# Altium schematic sheet v1.0.SchDoc
size 177 x 44 mm; PageSetup: Record=PageOptions|CenterHorizontal=True|CenterVertical=True|PrintScale=0.71|XCorrection=1.00|YCorrection=1.00|PrintKind=1|BorderSize=5000000|LeftOffset=0|BottomOffset=0|Orientation=2|PaperLength=1000|PaperWidth=1000|Scale=100|PaperSource=15|PrintQuality=4000|MediaType=1|DitherType=10|PrintScaleMode=1|PaperKind=A4|PaperIndex=9
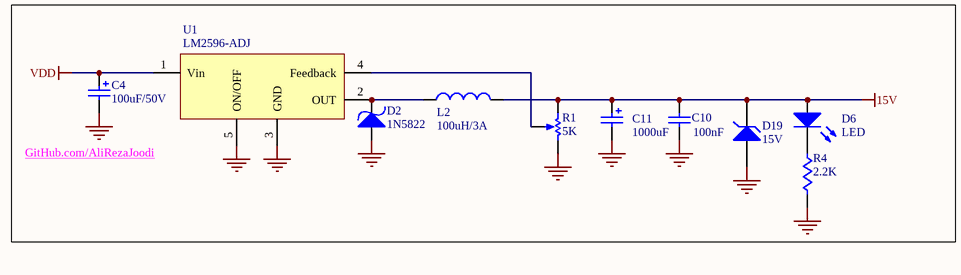
[diagram p0: v1.0.SchDoc]

## Parts
C4  value 100uF/50V  [CAPPR3.05-3.81x6.35]  (hidden comment: Cap Pol1)
C10  value 100nF  [CAPNTO2.54-3.05x1.78A]  (hidden comment: Cap)
C11  value 1000uF  [CAPPR5-10x12.5]  (hidden comment: Cap Pol1)
D2  Device: 1N5822  [DIODE-0.7]  (hidden comment: Diode_SCHOTTKY)
D6  LED  [LED-5mm_Red]
D19  value 15V  [DIODE0.4_Glass]  (hidden comment: D Zener)
L2  value 100uH/3A  [INDUCTOR-2V]  (hidden comment: Inductor)
R1  value 5K  [VR4_]  (hidden comment: R16)
R4  value 2.2K  [AXIAL-0.4]  (hidden comment: Res1)
U1  LM2596-ADJ  [TO220-5H]

## Nets
15V: C10.2 C11.1 D6.1(A) D19.2(K) L2.2 R1.2(BOT)
GND: C4.2 C10.1 C11.2 D2.1(A) D19.1(A) R1.1(TOP) R4.2 U1.3(GND) U1.5(ON/OFF)
VDD: C4.1 U1.1(Vin)
NetD2_2: D2.2(K) L2.1 U1.2(OUT)
NetD6_2: D6.2(K) R4.1
NetR1_3: R1.3(TAP) U1.4(Feedback)

## Notes on the sheet
- GitHub.com/AliRezaJoodi

## Library data of the parts
C4 C11 = Cap Pol1: Polarized Capacitor (Radial); Manufacturer: Generic Components; Class I: Passive; Published: 8-Jun-2000; Revision: July-2002: Re-released for DXP Platform.; Publisher: Altium Limited; Class II: Capacitor
C10 = Cap: Capacitor; Manufacturer: Generic Components; Class I: Passive; Published: 8-Jun-2000; Revision: July-2002: Re-released for DXP Platform.; Publisher: Altium Limited; Class II: Capacitor
D2 = Diode_SCHOTTKY: Diode; Manufacturer: Generic Components; Class I: Discrete; Class II: Diode - Switching; Published: 8-Jun-2000; Revision: July-2002: Re-released for DXP Platform.; Publisher: Altium Limited; Supplier 1: Farnell
D6 = LED: Typical INFRARED GaAs LED; Manufacturer: Generic Components; Class I: Optoelectronic; Published: 8-Jun-2000; Revision: July-2002: Re-released for DXP Platform.; Publisher: Altium Limited; Class II: LED
D19 = D Zener: Zener Diode; Manufacturer: Generic Components; Class I: Discrete; Class II: Diode - Zener; Published: 8-Jun-2000; Revision: July-2002: Re-released for DXP Platform.; Publisher: Altium Limited
L2 = Inductor: Manufacturer: Generic Components; Class I: Passive; Published: 8-Jun-2000; Revision: July-2002: Re-released for DXP Platform.; Publisher: Altium Limited; Class II: Inductor; Supplier 1: Newark
R1 = RPot1: Potentiometer; Manufacturer: Generic Components; Class I: Passive; Set Position: 0.5; Published: 8-Jun-2000; Revision: July-2002: Re-released for DXP Platform.; Publisher: Altium Limited; Class II: Potentiometer
R4 = Res1: Resistor; Manufacturer: Generic Components; Class I: Passive; Published: 8-Jun-2000; Revision: July-2002: Re-released for DXP Platform.; Publisher: Altium Limited; Class II: Resistor
U1 = LM2596: SWITCHER Power Converter 150 kHz3A Step-Down Voltage  Regulator